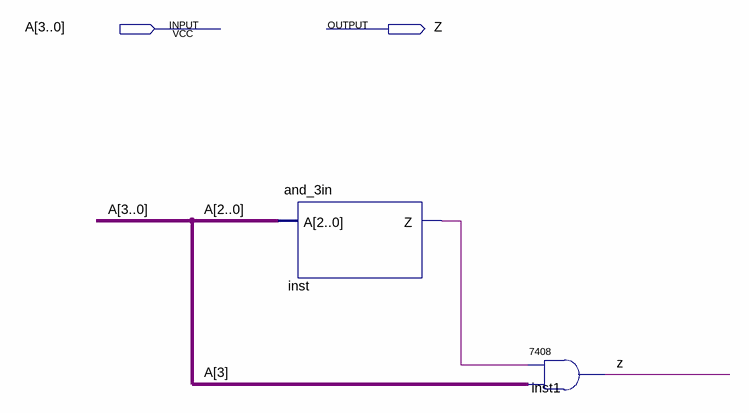
[diagram p0: schematic sheet]
// Quartus schematic and_4in.bdf as structural Verilog: 2 symbols, 2 pins
module and_4in (
  input  [3:0] A,
  output Z
);

  wire inst_z;

  and_3in inst (.A(A[2:0]), .Z(inst_z));
  \7408  inst1 (.\3 (A[3]), .\2 (inst_z), .\1 (Z));
endmodule
